# Altium schematic sheet SCH-9-Battery Voltage Indicators.SchDoc
size B
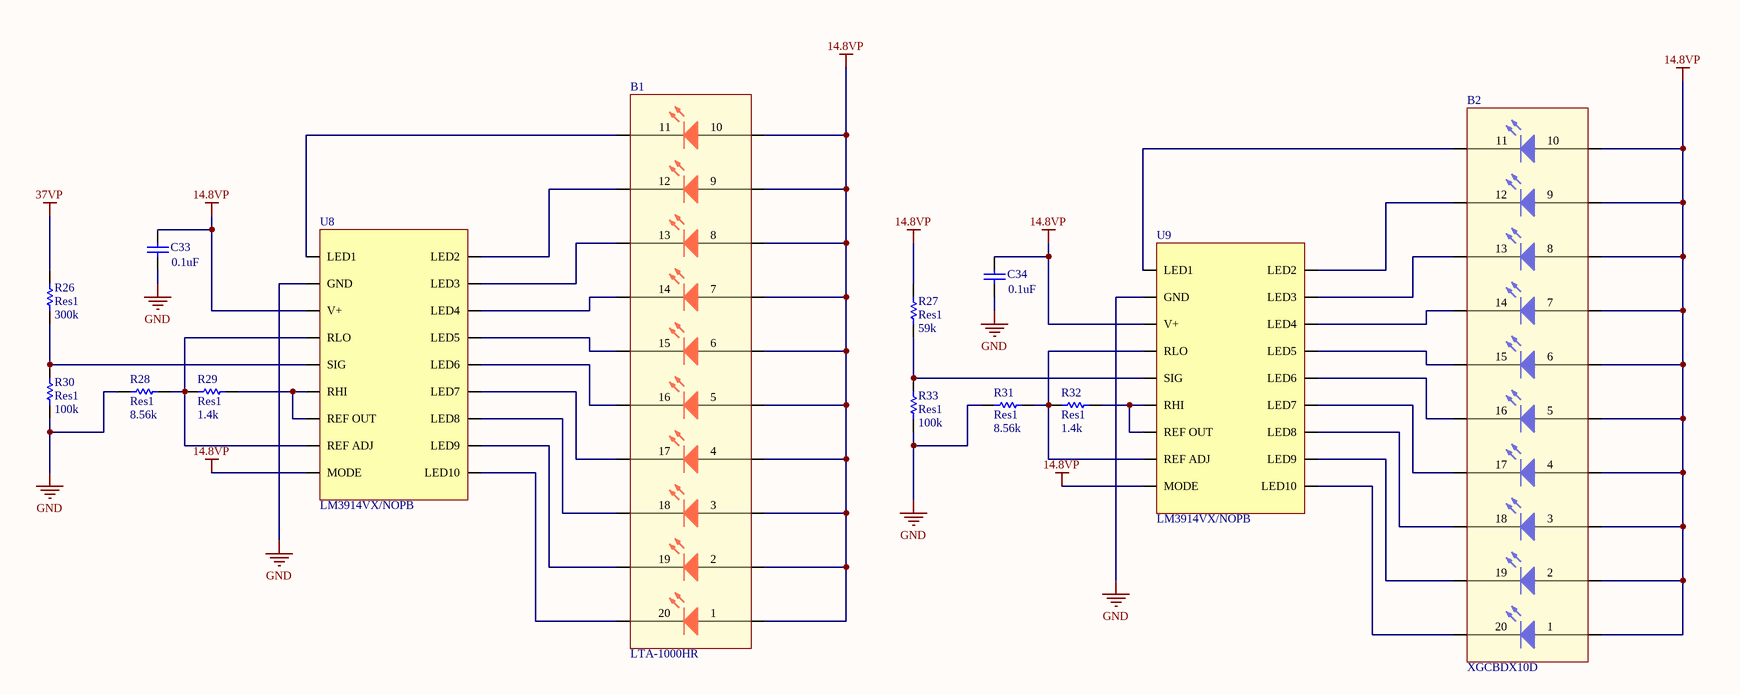
[diagram p0: SCH-9-Battery Voltage Indicators.SchDoc]

## Parts
B1  LTA-1000HR  [LED BAR 10pos]
B2  XGCBDX10D  [LED BAR 10pos]
C33  value 0.1uF  [C1206]  (hidden comment: Cap Semi)
C34  value 0.1uF  [C1206]  (hidden comment: Cap Semi)
R26  Res1  value 300k  [RESC1608X06N_0603]
R27  Res1  value 59k  [RESC1608X06N_0603]
R28  Res1  value 8.56k  [RESC1608X06N_0603]
R29  Res1  value 1.4k  [RESC1608X06N_0603]
R30  Res1  value 100k  [RESC1608X06N_0603]
R31  Res1  value 8.56k  [RESC1608X06N_0603]
R32  Res1  value 1.4k  [RESC1608X06N_0603]
R33  Res1  value 100k  [RESC1608X06N_0603]
U8  LM3914VX/NOPB  [PLCC127P990X990X457-20N]
U9  LM3914VX/NOPB  [PLCC127P990X990X457-20N]

## Nets
14.8VP: B1.1(A) B1.2(A) B1.3(A) B1.4(A) B1.5(A) B1.6(A) B1.7(A) B1.8(A) B1.9(A) B1.10(A) B2.1(A) B2.2(A) B2.3(A) B2.4(A) B2.5(A) B2.6(A) B2.7(A) B2.8(A) B2.9(A) B2.10(A) C33.2 C34.2 R27.2 U8.3(V+) U8.11(MODE) U9.3(V+) U9.11(MODE)
37VP: R26.2
GND: C33.1 C34.1 R28.1 R30.1 R31.1 R33.1 U8.2(GND) U9.2(GND)
NetB1_11: B1.11(K) U8.1(LED1)
NetB1_12: B1.12(K) U8.20(LED2)
NetB1_13: B1.13(K) U8.19(LED3)
NetB1_14: B1.14(K) U8.18(LED4)
NetB1_15: B1.15(K) U8.17(LED5)
NetB1_16: B1.16(K) U8.16(LED6)
NetB1_17: B1.17(K) U8.15(LED7)
NetB1_18: B1.18(K) U8.14(LED8)
NetB1_19: B1.19(K) U8.13(LED9)
NetB1_20: B1.20(K) U8.12(LED10)
NetB2_11: B2.11(K) U9.1(LED1)
NetB2_12: B2.12(K) U9.20(LED2)
NetB2_13: B2.13(K) U9.19(LED3)
NetB2_14: B2.14(K) U9.18(LED4)
NetB2_15: B2.15(K) U9.17(LED5)
NetB2_16: B2.16(K) U9.16(LED6)
NetB2_17: B2.17(K) U9.15(LED7)
NetB2_18: B2.18(K) U9.14(LED8)
NetB2_19: B2.19(K) U9.13(LED9)
NetB2_20: B2.20(K) U9.12(LED10)
NetR26_1: R26.1 R30.2 U8.5(SIG)
NetR27_1: R27.1 R33.2 U9.5(SIG)
NetR28_2: R28.2 R29.1 U8.4(RLO) U8.10(REF_ADJ)
NetR29_2: R29.2 U8.6(RHI) U8.8(REF_OUT)
NetR31_2: R31.2 R32.1 U9.4(RLO) U9.10(REF_ADJ)
NetR32_2: R32.2 U9.6(RHI) U9.8(REF_OUT)

## Library data of the parts
B1 = LED BAR 10 RED
B2 = LED BAR 10 BLUE
C33 C34 = Cap Semi: Capacitor (Semiconductor SIM Model); Published: 8-Jun-2000; LatestRevisionDate: 29-May-2009; LatestRevisionNote: IPC-7351 Footprint Added.; PackageReference: C1206; Publisher: Altium Limited; PackageDescription: Chip Capacitor
R26-R33 = Res1: Resistor; Published: 8-Jun-2000; LatestRevisionDate: 17-Jul-2002; LatestRevisionNote: Re-released for DXP Platform.; PackageReference: AXIAL-0.3; Publisher: Altium Limited; PackageDescription: Axial Device, Thru-Hole; 2 Leads; 0.3 in Pin Spacing
U8 U9 = LM3914